# EAGLE design tcspc (EAGLE 9.1.2)

## Sheet 1 of 4
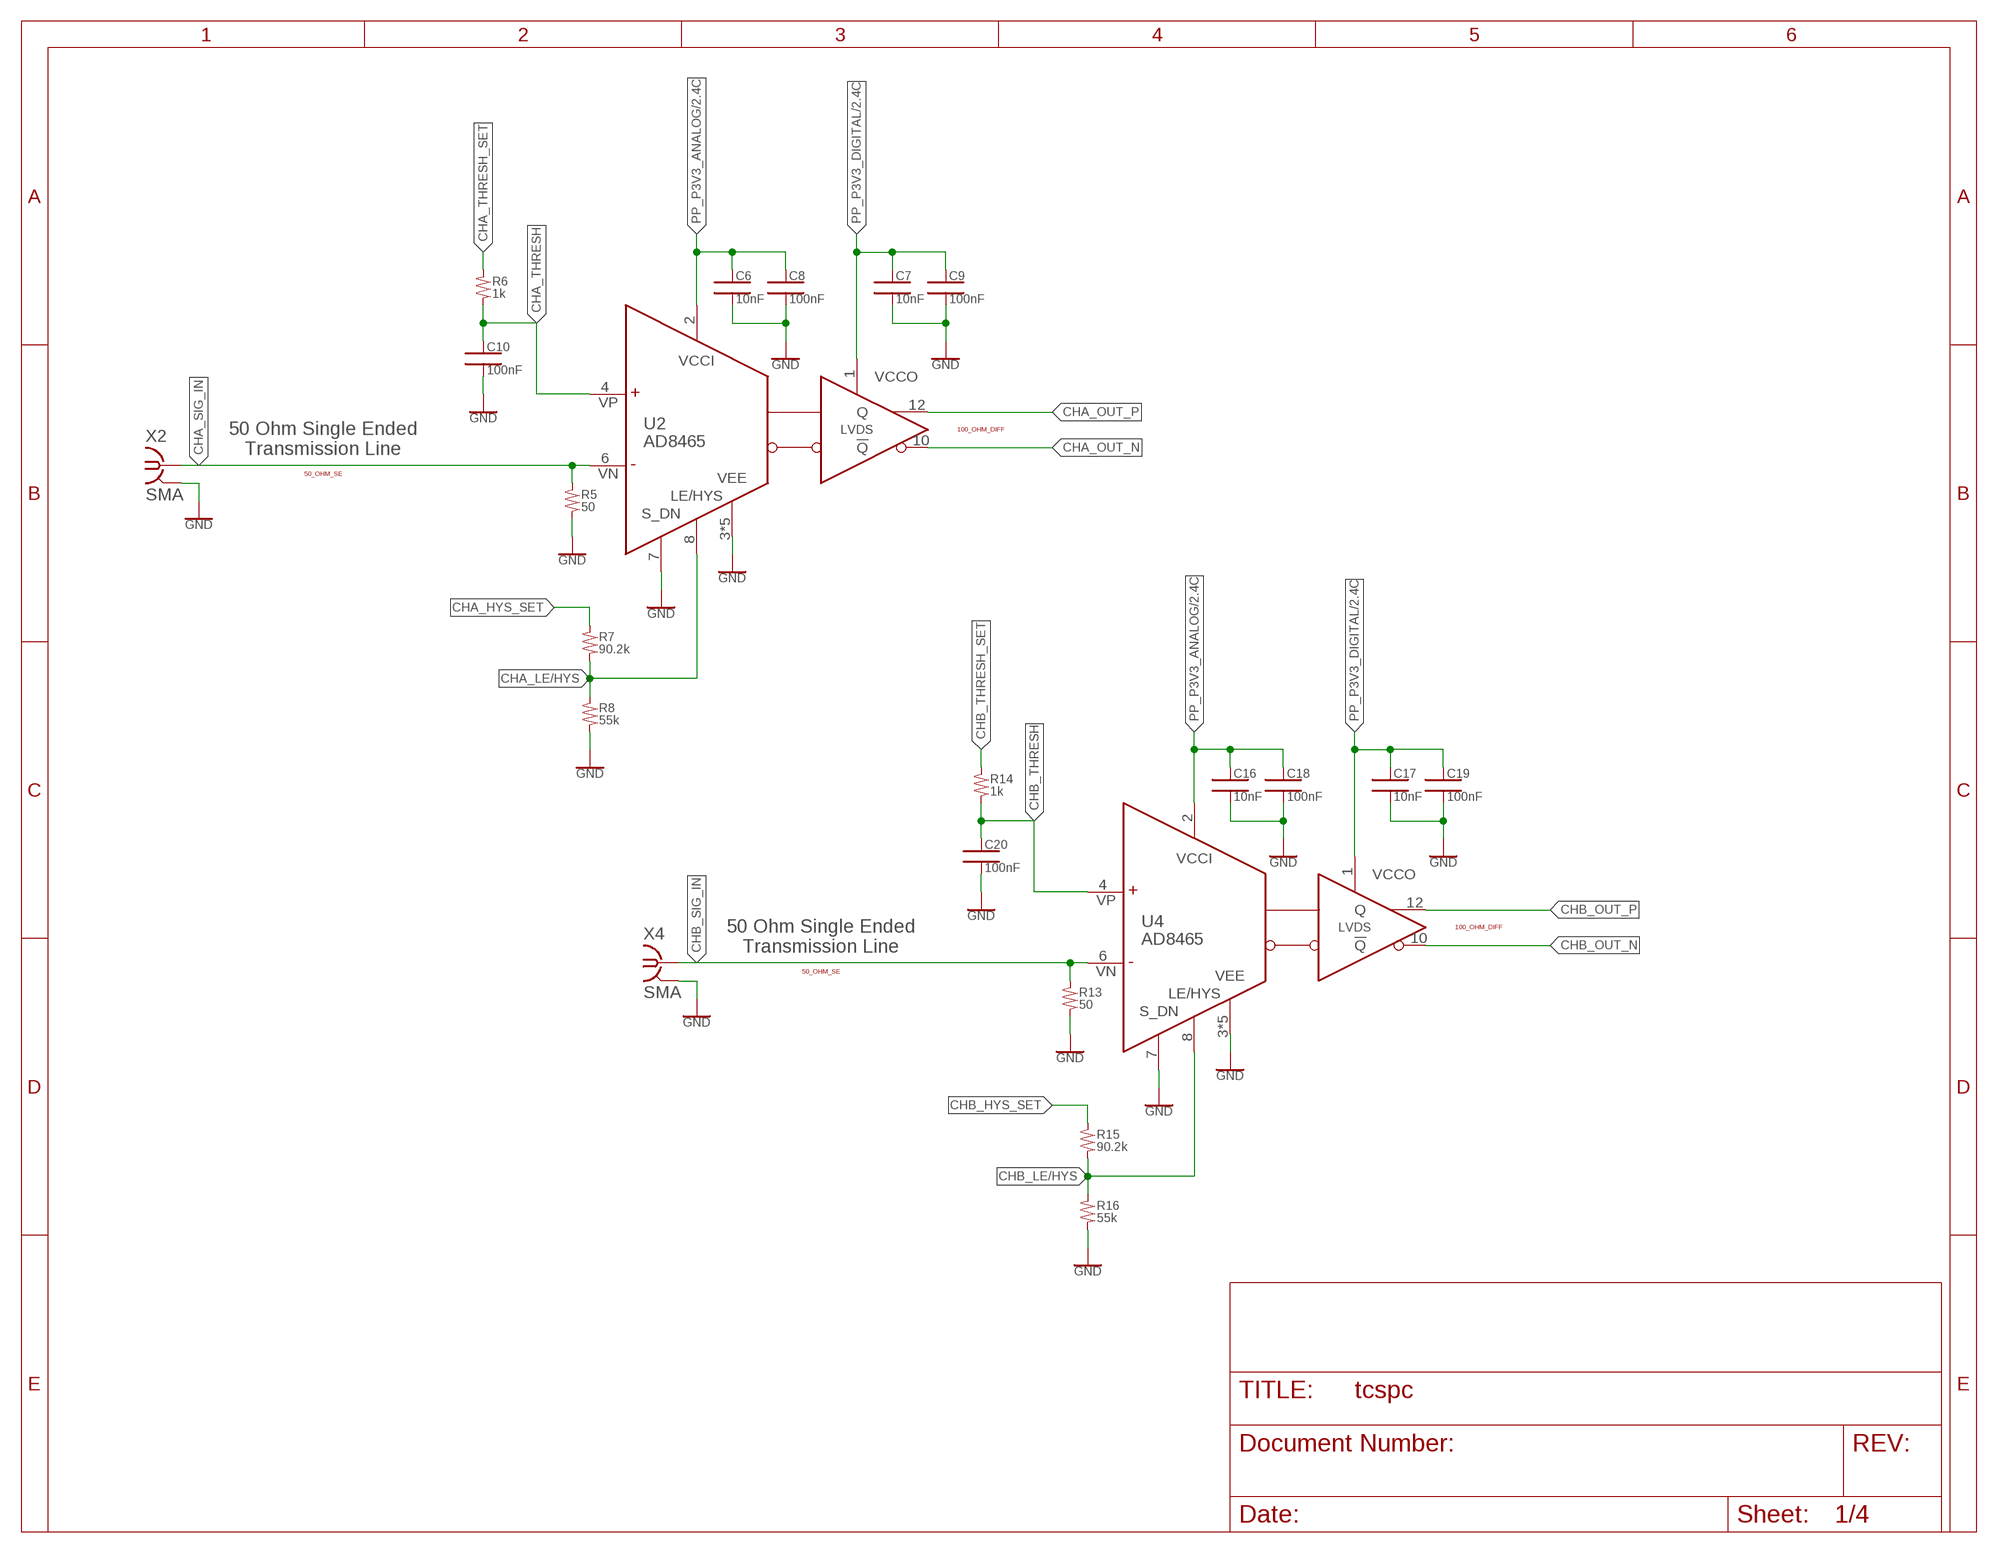
[diagram p0: schematic, sheet 1]

### Parts
C6  10nF  CAP_0402  [0402]
C7  10nF  CAP_0402  [0402]
C8  100nF  CAP_0402  [0402]
C9  100nF  CAP_0402  [0402]
C10  100nF  CAP_0402  [0402]
C16  10nF  CAP_0402  [0402]
C17  10nF  CAP_0402  [0402]
C18  100nF  CAP_0402  [0402]
C19  100nF  CAP_0402  [0402]
C20  100nF  CAP_0402  [0402]
R5  50  RES_0402  [0402]
R6  1k  RES_0402  [0402]
R7  90.2k  RES_0402  [0402]
R8  55k  RES_0402  [0402]
R13  50  RES_0402  [0402]
R14  1k  RES_0402  [0402]
R15  90.2k  RES_0402  [0402]
R16  55k  RES_0402  [0402]
U2  AD8465  [LFCSP-12]
U4  AD8465  [LFCSP-12]
X2  SMA  [J502-ND-142-0701-881/886]
X4  SMA  [J502-ND-142-0701-881/886]

### Nets
CHA_HYS_SET: R7.1
CHA_LE/HYS: R7.2 R8.1 U2.8(LE/HYS)
CHA_OUT_N [100_OHM_DIFF]: U2.10(!Q)
CHA_OUT_P [100_OHM_DIFF]: U2.12(Q)
CHA_SIG_IN: R5.1 U2.6(VN) X2.1
CHA_THRESH: C10.1 R6.2 U2.4(VP)
CHA_THRESH_SET: R6.1
CHB_HYS_SET: R15.1
CHB_LE/HYS: R15.2 R16.1 U4.8(LE/HYS)
CHB_OUT_N [100_OHM_DIFF]: U4.10(!Q)
CHB_OUT_P [100_OHM_DIFF]: U4.12(Q)
CHB_SIG_IN: R13.1 U4.6(VN) X4.1
CHB_THRESH: C20.1 R14.2 U4.4(VP)
CHB_THRESH_SET: R14.1
GND: C6.2 C7.2 C8.2 C9.2 C10.2 C16.2 C17.2 C18.2 C19.2 C20.2 R5.2 R8.2 R13.2 R16.2 U2.3(VEE) U2.5(VEE) U2.7(SDN) U2.9(VEE) U2.11(VEE) U2.EPAD(VEE) U4.3(VEE) U4.5(VEE) U4.7(SDN) U4.9(VEE) U4.11(VEE) U4.EPAD(VEE) X2.G@1(GND) X2.G@2(GND) X2.G@3(GND) X2.G@4(GND) X4.G@1(GND) X4.G@2(GND) X4.G@3(GND) X4.G@4(GND) ; also sheet 2,3,4
PP_P3V3_ANALOG: C6.1 C8.1 C16.1 C18.1 U2.2(VCCI) U4.2(VCCI) ; also sheet 2,4
PP_P3V3_DIGITAL: C7.1 C9.1 C17.1 C19.1 U2.1(VCCO) U4.1(VCCO) ; also sheet 2,4

### Notes on the sheet
- 100_OHM_DIFF
- 50 Ohm Single Ended
  Transmission Line
- 50_OHM_SE
- 100_OHM_DIFF
- 50 Ohm Single Ended
  Transmission Line
- 50_OHM_SE

## Sheet 2 of 4
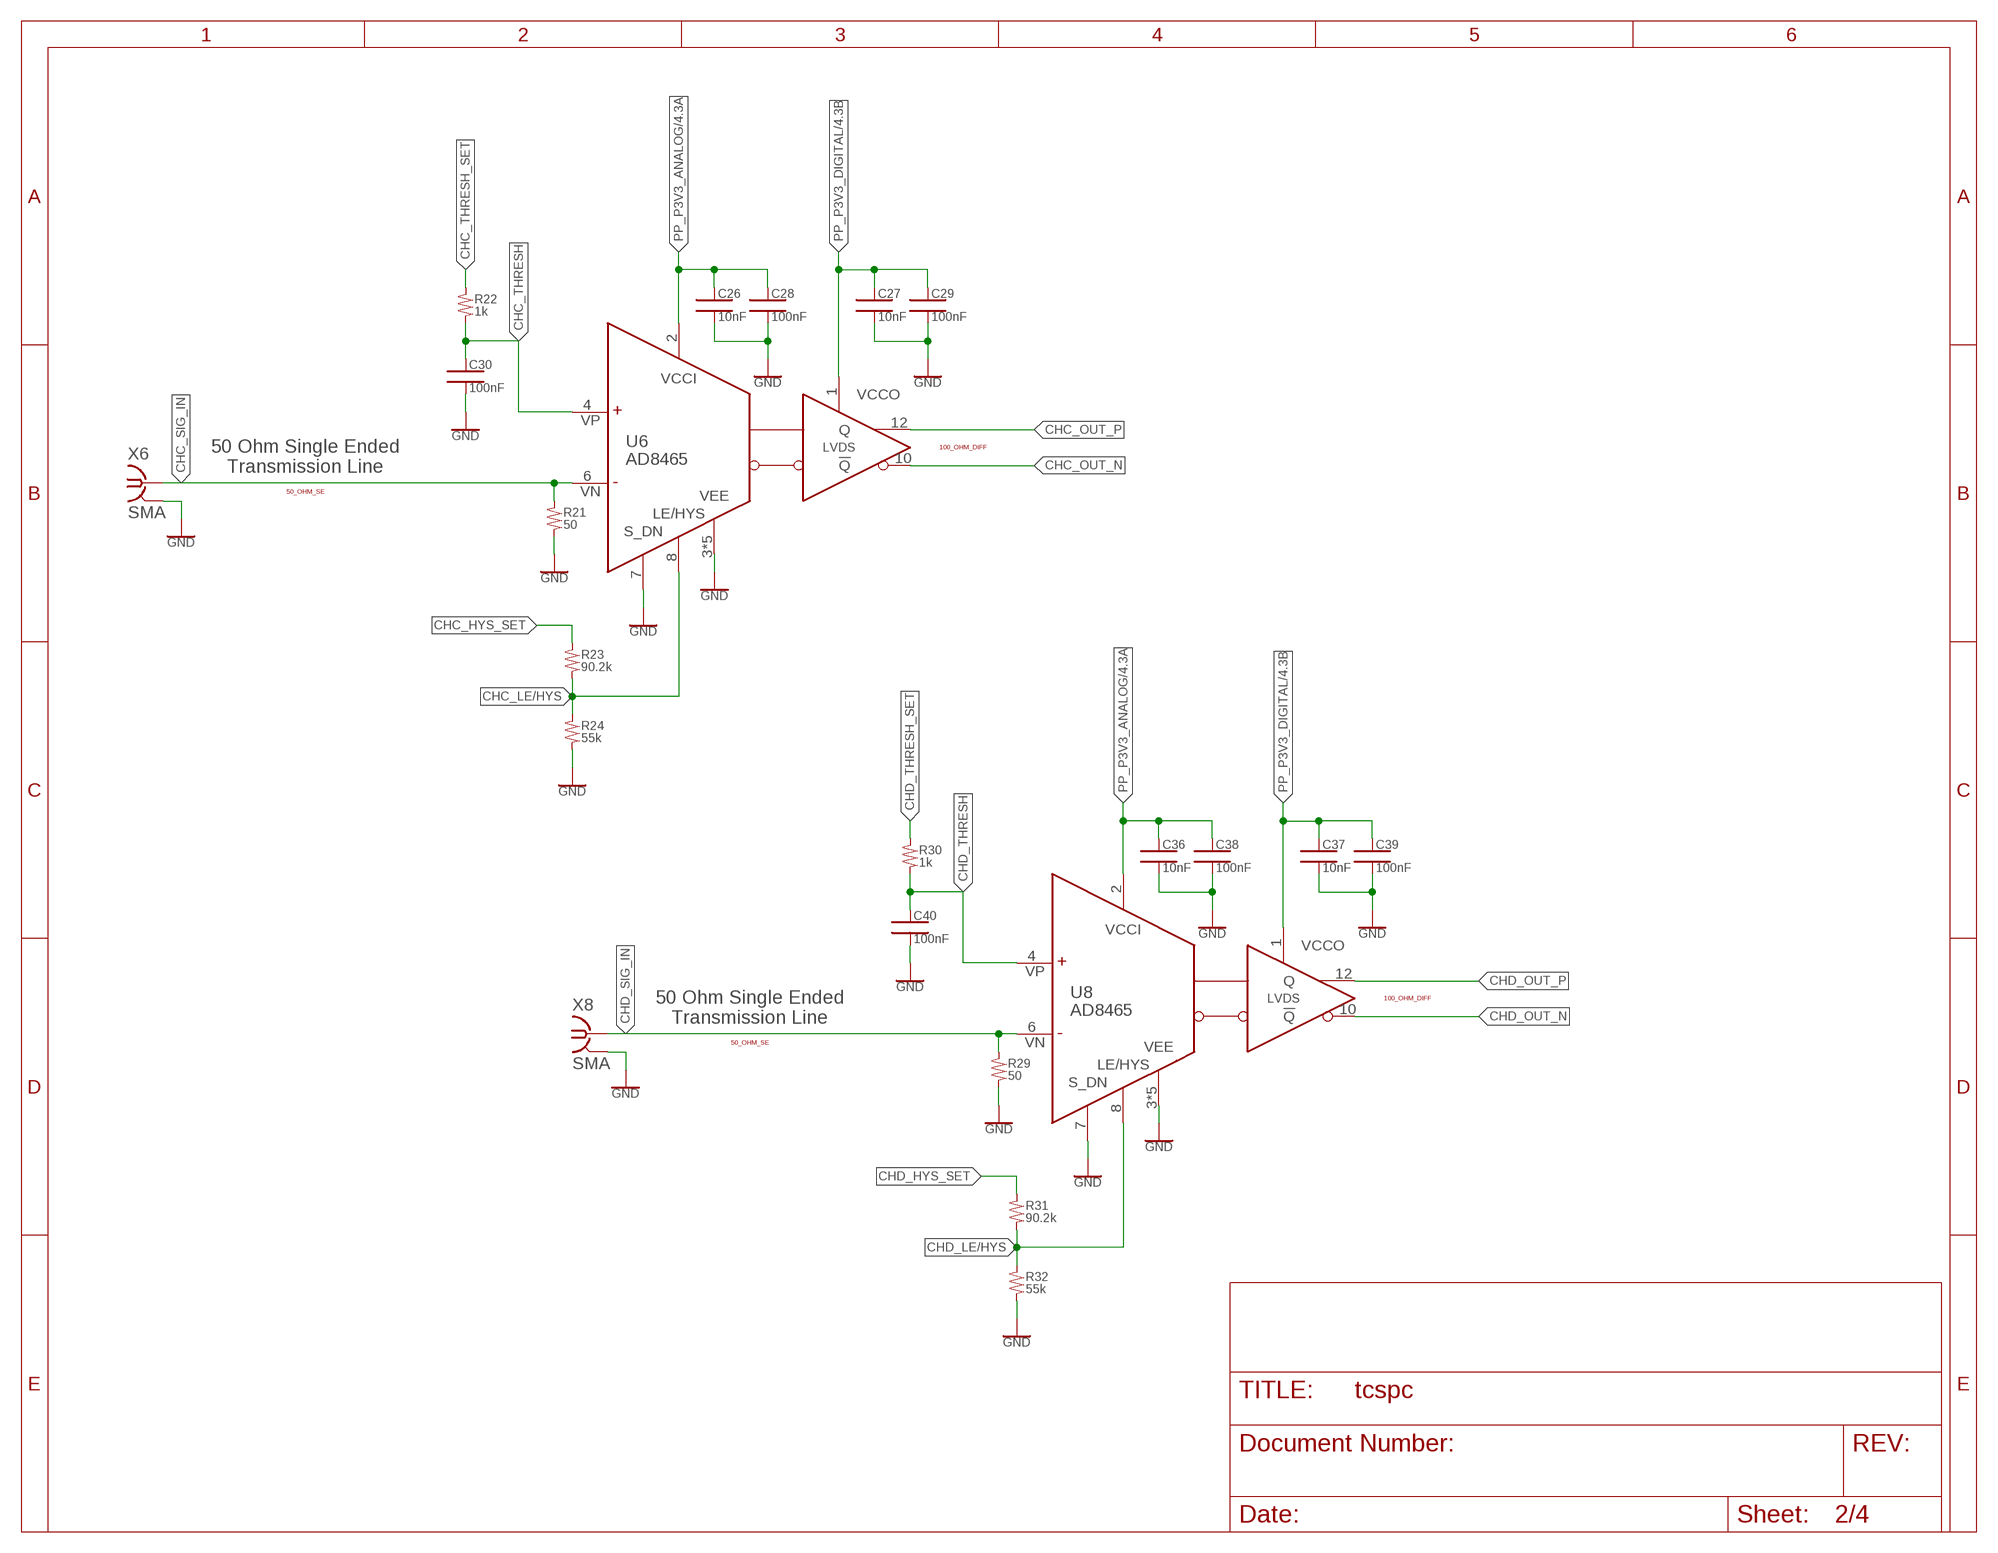
[diagram p1: schematic, sheet 2]

### Parts
C26  10nF  CAP_0402  [0402]
C27  10nF  CAP_0402  [0402]
C28  100nF  CAP_0402  [0402]
C29  100nF  CAP_0402  [0402]
C30  100nF  CAP_0402  [0402]
C36  10nF  CAP_0402  [0402]
C37  10nF  CAP_0402  [0402]
C38  100nF  CAP_0402  [0402]
C39  100nF  CAP_0402  [0402]
C40  100nF  CAP_0402  [0402]
R21  50  RES_0402  [0402]
R22  1k  RES_0402  [0402]
R23  90.2k  RES_0402  [0402]
R24  55k  RES_0402  [0402]
R29  50  RES_0402  [0402]
R30  1k  RES_0402  [0402]
R31  90.2k  RES_0402  [0402]
R32  55k  RES_0402  [0402]
U6  AD8465  [LFCSP-12]
U8  AD8465  [LFCSP-12]
X6  SMA  [J502-ND-142-0701-881/886]
X8  SMA  [J502-ND-142-0701-881/886]

### Nets
CHC_HYS_SET: R23.1
CHC_LE/HYS: R23.2 R24.1 U6.8(LE/HYS)
CHC_OUT_N [100_OHM_DIFF]: U6.10(!Q)
CHC_OUT_P [100_OHM_DIFF]: U6.12(Q)
CHC_SIG_IN: R21.1 U6.6(VN) X6.1
CHC_THRESH: C30.1 R22.2 U6.4(VP)
CHC_THRESH_SET: R22.1
CHD_HYS_SET: R31.1
CHD_LE/HYS: R31.2 R32.1 U8.8(LE/HYS)
CHD_OUT_N [100_OHM_DIFF]: U8.10(!Q)
CHD_OUT_P [100_OHM_DIFF]: U8.12(Q)
CHD_SIG_IN: R29.1 U8.6(VN) X8.1
CHD_THRESH: C40.1 R30.2 U8.4(VP)
CHD_THRESH_SET: R30.1
GND: C26.2 C27.2 C28.2 C29.2 C30.2 C36.2 C37.2 C38.2 C39.2 C40.2 R21.2 R24.2 R29.2 R32.2 U6.3(VEE) U6.5(VEE) U6.7(SDN) U6.9(VEE) U6.11(VEE) U6.EPAD(VEE) U8.3(VEE) U8.5(VEE) U8.7(SDN) U8.9(VEE) U8.11(VEE) U8.EPAD(VEE) X6.G@1(GND) X6.G@2(GND) X6.G@3(GND) X6.G@4(GND) X8.G@1(GND) X8.G@2(GND) X8.G@3(GND) X8.G@4(GND) ; also sheet 1,3,4
PP_P3V3_ANALOG: C26.1 C28.1 C36.1 C38.1 U6.2(VCCI) U8.2(VCCI) ; also sheet 1,4
PP_P3V3_DIGITAL: C27.1 C29.1 C37.1 C39.1 U6.1(VCCO) U8.1(VCCO) ; also sheet 1,4

### Notes on the sheet
- 100_OHM_DIFF
- 50 Ohm Single Ended
  Transmission Line
- 50_OHM_SE
- 100_OHM_DIFF
- 50 Ohm Single Ended
  Transmission Line
- 50_OHM_SE

## Sheet 3 of 4
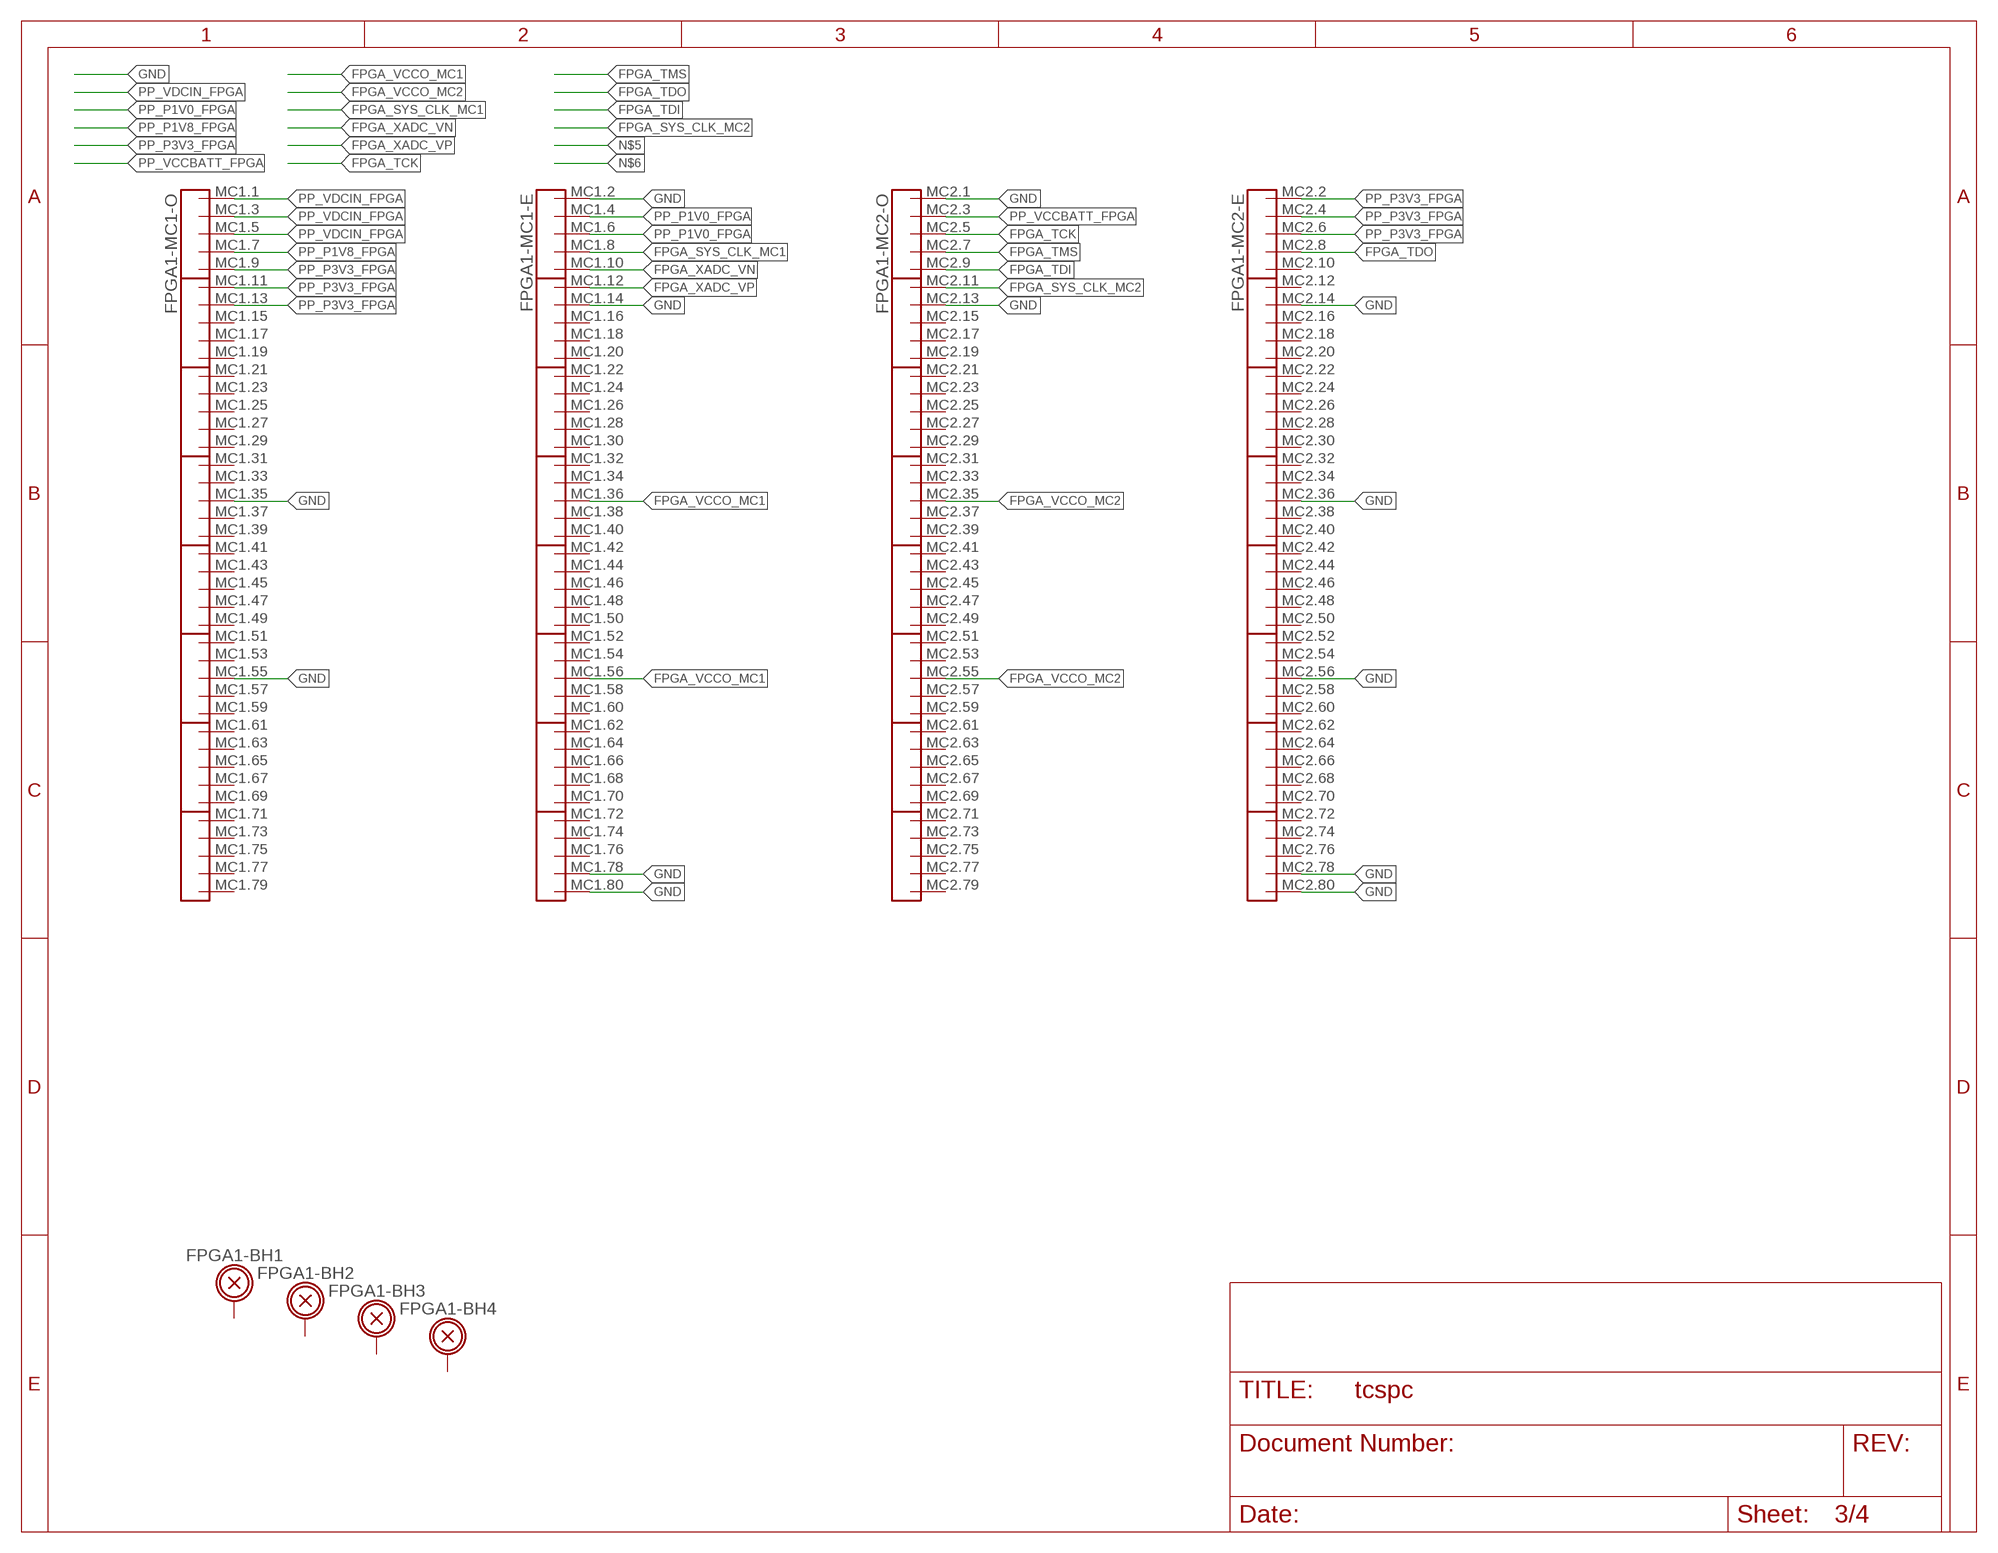
[diagram p2: schematic, sheet 3]

### Parts
FPGA1  XEM7310  [XEM7310]

### Nets
FPGA_SYS_CLK_MC1: FPGA1.MC1.8(-MC1-E:P4)
FPGA_SYS_CLK_MC2: FPGA1.MC2.11(-MC2-O:P6)
FPGA_TCK: FPGA1.MC2.5(-MC2-O:P3)
FPGA_TDI: FPGA1.MC2.9(-MC2-O:P5)
FPGA_TDO: FPGA1.MC2.8(-MC2-E:P4)
FPGA_TMS: FPGA1.MC2.7(-MC2-O:P4)
FPGA_VCCO_MC1: FPGA1.MC1.36(-MC1-E:P18) FPGA1.MC1.56(-MC1-E:P28)
FPGA_VCCO_MC2: FPGA1.MC2.35(-MC2-O:P18) FPGA1.MC2.55(-MC2-O:P28)
FPGA_XADC_VN: FPGA1.MC1.10(-MC1-E:P5)
FPGA_XADC_VP: FPGA1.MC1.12(-MC1-E:P6)
GND: FPGA1.MC1.2(-MC1-E:P1) FPGA1.MC1.14(-MC1-E:P7) FPGA1.MC1.35(-MC1-O:P18) FPGA1.MC1.55(-MC1-O:P28) FPGA1.MC1.78(-MC1-E:P39) FPGA1.MC1.80(-MC1-E:P40) FPGA1.MC2.1(-MC2-O:P1) FPGA1.MC2.13(-MC2-O:P7) FPGA1.MC2.14(-MC2-E:P7) FPGA1.MC2.36(-MC2-E:P18) FPGA1.MC2.56(-MC2-E:P28) FPGA1.MC2.78(-MC2-E:P39) FPGA1.MC2.80(-MC2-E:P40) ; also sheet 1,2,4
PP_P1V0_FPGA: FPGA1.MC1.4(-MC1-E:P2) FPGA1.MC1.6(-MC1-E:P3)
PP_P1V8_FPGA: FPGA1.MC1.7(-MC1-O:P4)
PP_P3V3_FPGA: FPGA1.MC1.9(-MC1-O:P5) FPGA1.MC1.11(-MC1-O:P6) FPGA1.MC1.13(-MC1-O:P7) FPGA1.MC2.2(-MC2-E:P1) FPGA1.MC2.4(-MC2-E:P2) FPGA1.MC2.6(-MC2-E:P3)
PP_VCCBATT_FPGA: FPGA1.MC2.3(-MC2-O:P2)
PP_VDCIN_FPGA: FPGA1.MC1.1(-MC1-O:P1) FPGA1.MC1.3(-MC1-O:P2) FPGA1.MC1.5(-MC1-O:P3)
Unconnected: FPGA1.BH1(-BH1:P) FPGA1.BH2(-BH2:P) FPGA1.BH3(-BH3:P) FPGA1.BH4(-BH4:P) FPGA1.MC1.15(-MC1-O:P8) FPGA1.MC1.16(-MC1-E:P8) FPGA1.MC1.17(-MC1-O:P9) FPGA1.MC1.18(-MC1-E:P9) FPGA1.MC1.19(-MC1-O:P10) FPGA1.MC1.20(-MC1-E:P10) FPGA1.MC1.21(-MC1-O:P11) FPGA1.MC1.22(-MC1-E:P11) FPGA1.MC1.23(-MC1-O:P12) FPGA1.MC1.24(-MC1-E:P12) FPGA1.MC1.25(-MC1-O:P13) FPGA1.MC1.26(-MC1-E:P13) FPGA1.MC1.27(-MC1-O:P14) FPGA1.MC1.28(-MC1-E:P14) FPGA1.MC1.29(-MC1-O:P15) FPGA1.MC1.30(-MC1-E:P15) FPGA1.MC1.31(-MC1-O:P16) FPGA1.MC1.32(-MC1-E:P16) FPGA1.MC1.33(-MC1-O:P17) FPGA1.MC1.34(-MC1-E:P17) FPGA1.MC1.37(-MC1-O:P19) FPGA1.MC1.38(-MC1-E:P19) FPGA1.MC1.39(-MC1-O:P20) FPGA1.MC1.40(-MC1-E:P20) FPGA1.MC1.41(-MC1-O:P21) FPGA1.MC1.42(-MC1-E:P21) FPGA1.MC1.43(-MC1-O:P22) FPGA1.MC1.44(-MC1-E:P22) FPGA1.MC1.45(-MC1-O:P23) FPGA1.MC1.46(-MC1-E:P23) FPGA1.MC1.47(-MC1-O:P24) FPGA1.MC1.48(-MC1-E:P24) FPGA1.MC1.49(-MC1-O:P25) FPGA1.MC1.50(-MC1-E:P25) FPGA1.MC1.51(-MC1-O:P26) FPGA1.MC1.52(-MC1-E:P26) FPGA1.MC1.53(-MC1-O:P27) FPGA1.MC1.54(-MC1-E:P27) FPGA1.MC1.57(-MC1-O:P29) FPGA1.MC1.58(-MC1-E:P29) FPGA1.MC1.59(-MC1-O:P30) FPGA1.MC1.60(-MC1-E:P30) FPGA1.MC1.61(-MC1-O:P31) FPGA1.MC1.62(-MC1-E:P31) FPGA1.MC1.63(-MC1-O:P32) FPGA1.MC1.64(-MC1-E:P32) FPGA1.MC1.65(-MC1-O:P33) FPGA1.MC1.66(-MC1-E:P33) FPGA1.MC1.67(-MC1-O:P34) FPGA1.MC1.68(-MC1-E:P34) FPGA1.MC1.69(-MC1-O:P35) FPGA1.MC1.70(-MC1-E:P35) FPGA1.MC1.71(-MC1-O:P36) FPGA1.MC1.72(-MC1-E:P36) FPGA1.MC1.73(-MC1-O:P37) FPGA1.MC1.74(-MC1-E:P37) FPGA1.MC1.75(-MC1-O:P38) FPGA1.MC1.76(-MC1-E:P38) FPGA1.MC1.77(-MC1-O:P39) FPGA1.MC1.79(-MC1-O:P40) FPGA1.MC2.10(-MC2-E:P5) FPGA1.MC2.12(-MC2-E:P6) FPGA1.MC2.15(-MC2-O:P8) FPGA1.MC2.16(-MC2-E:P8) FPGA1.MC2.17(-MC2-O:P9) FPGA1.MC2.18(-MC2-E:P9) FPGA1.MC2.19(-MC2-O:P10) FPGA1.MC2.20(-MC2-E:P10) FPGA1.MC2.21(-MC2-O:P11) FPGA1.MC2.22(-MC2-E:P11) FPGA1.MC2.23(-MC2-O:P12) FPGA1.MC2.24(-MC2-E:P12) FPGA1.MC2.25(-MC2-O:P13) FPGA1.MC2.26(-MC2-E:P13) FPGA1.MC2.27(-MC2-O:P14) FPGA1.MC2.28(-MC2-E:P14) FPGA1.MC2.29(-MC2-O:P15) FPGA1.MC2.30(-MC2-E:P15) FPGA1.MC2.31(-MC2-O:P16) FPGA1.MC2.32(-MC2-E:P16) FPGA1.MC2.33(-MC2-O:P17) FPGA1.MC2.34(-MC2-E:P17) FPGA1.MC2.37(-MC2-O:P19) FPGA1.MC2.38(-MC2-E:P19) FPGA1.MC2.39(-MC2-O:P20) FPGA1.MC2.40(-MC2-E:P20) FPGA1.MC2.41(-MC2-O:P21) FPGA1.MC2.42(-MC2-E:P21) FPGA1.MC2.43(-MC2-O:P22) FPGA1.MC2.44(-MC2-E:P22) FPGA1.MC2.45(-MC2-O:P23) FPGA1.MC2.46(-MC2-E:P23) FPGA1.MC2.47(-MC2-O:P24) FPGA1.MC2.48(-MC2-E:P24) FPGA1.MC2.49(-MC2-O:P25) FPGA1.MC2.50(-MC2-E:P25) FPGA1.MC2.51(-MC2-O:P26) FPGA1.MC2.52(-MC2-E:P26) FPGA1.MC2.53(-MC2-O:P27) FPGA1.MC2.54(-MC2-E:P27) FPGA1.MC2.57(-MC2-O:P29) FPGA1.MC2.58(-MC2-E:P29) FPGA1.MC2.59(-MC2-O:P30) FPGA1.MC2.60(-MC2-E:P30) FPGA1.MC2.61(-MC2-O:P31) FPGA1.MC2.62(-MC2-E:P31) FPGA1.MC2.63(-MC2-O:P32) FPGA1.MC2.64(-MC2-E:P32) FPGA1.MC2.65(-MC2-O:P33) FPGA1.MC2.66(-MC2-E:P33) FPGA1.MC2.67(-MC2-O:P34) FPGA1.MC2.68(-MC2-E:P34) FPGA1.MC2.69(-MC2-O:P35) FPGA1.MC2.70(-MC2-E:P35) FPGA1.MC2.71(-MC2-O:P36) FPGA1.MC2.72(-MC2-E:P36) FPGA1.MC2.73(-MC2-O:P37) FPGA1.MC2.74(-MC2-E:P37) FPGA1.MC2.75(-MC2-O:P38) FPGA1.MC2.76(-MC2-E:P38) FPGA1.MC2.77(-MC2-O:P39) FPGA1.MC2.79(-MC2-O:P40)

## Sheet 4 of 4
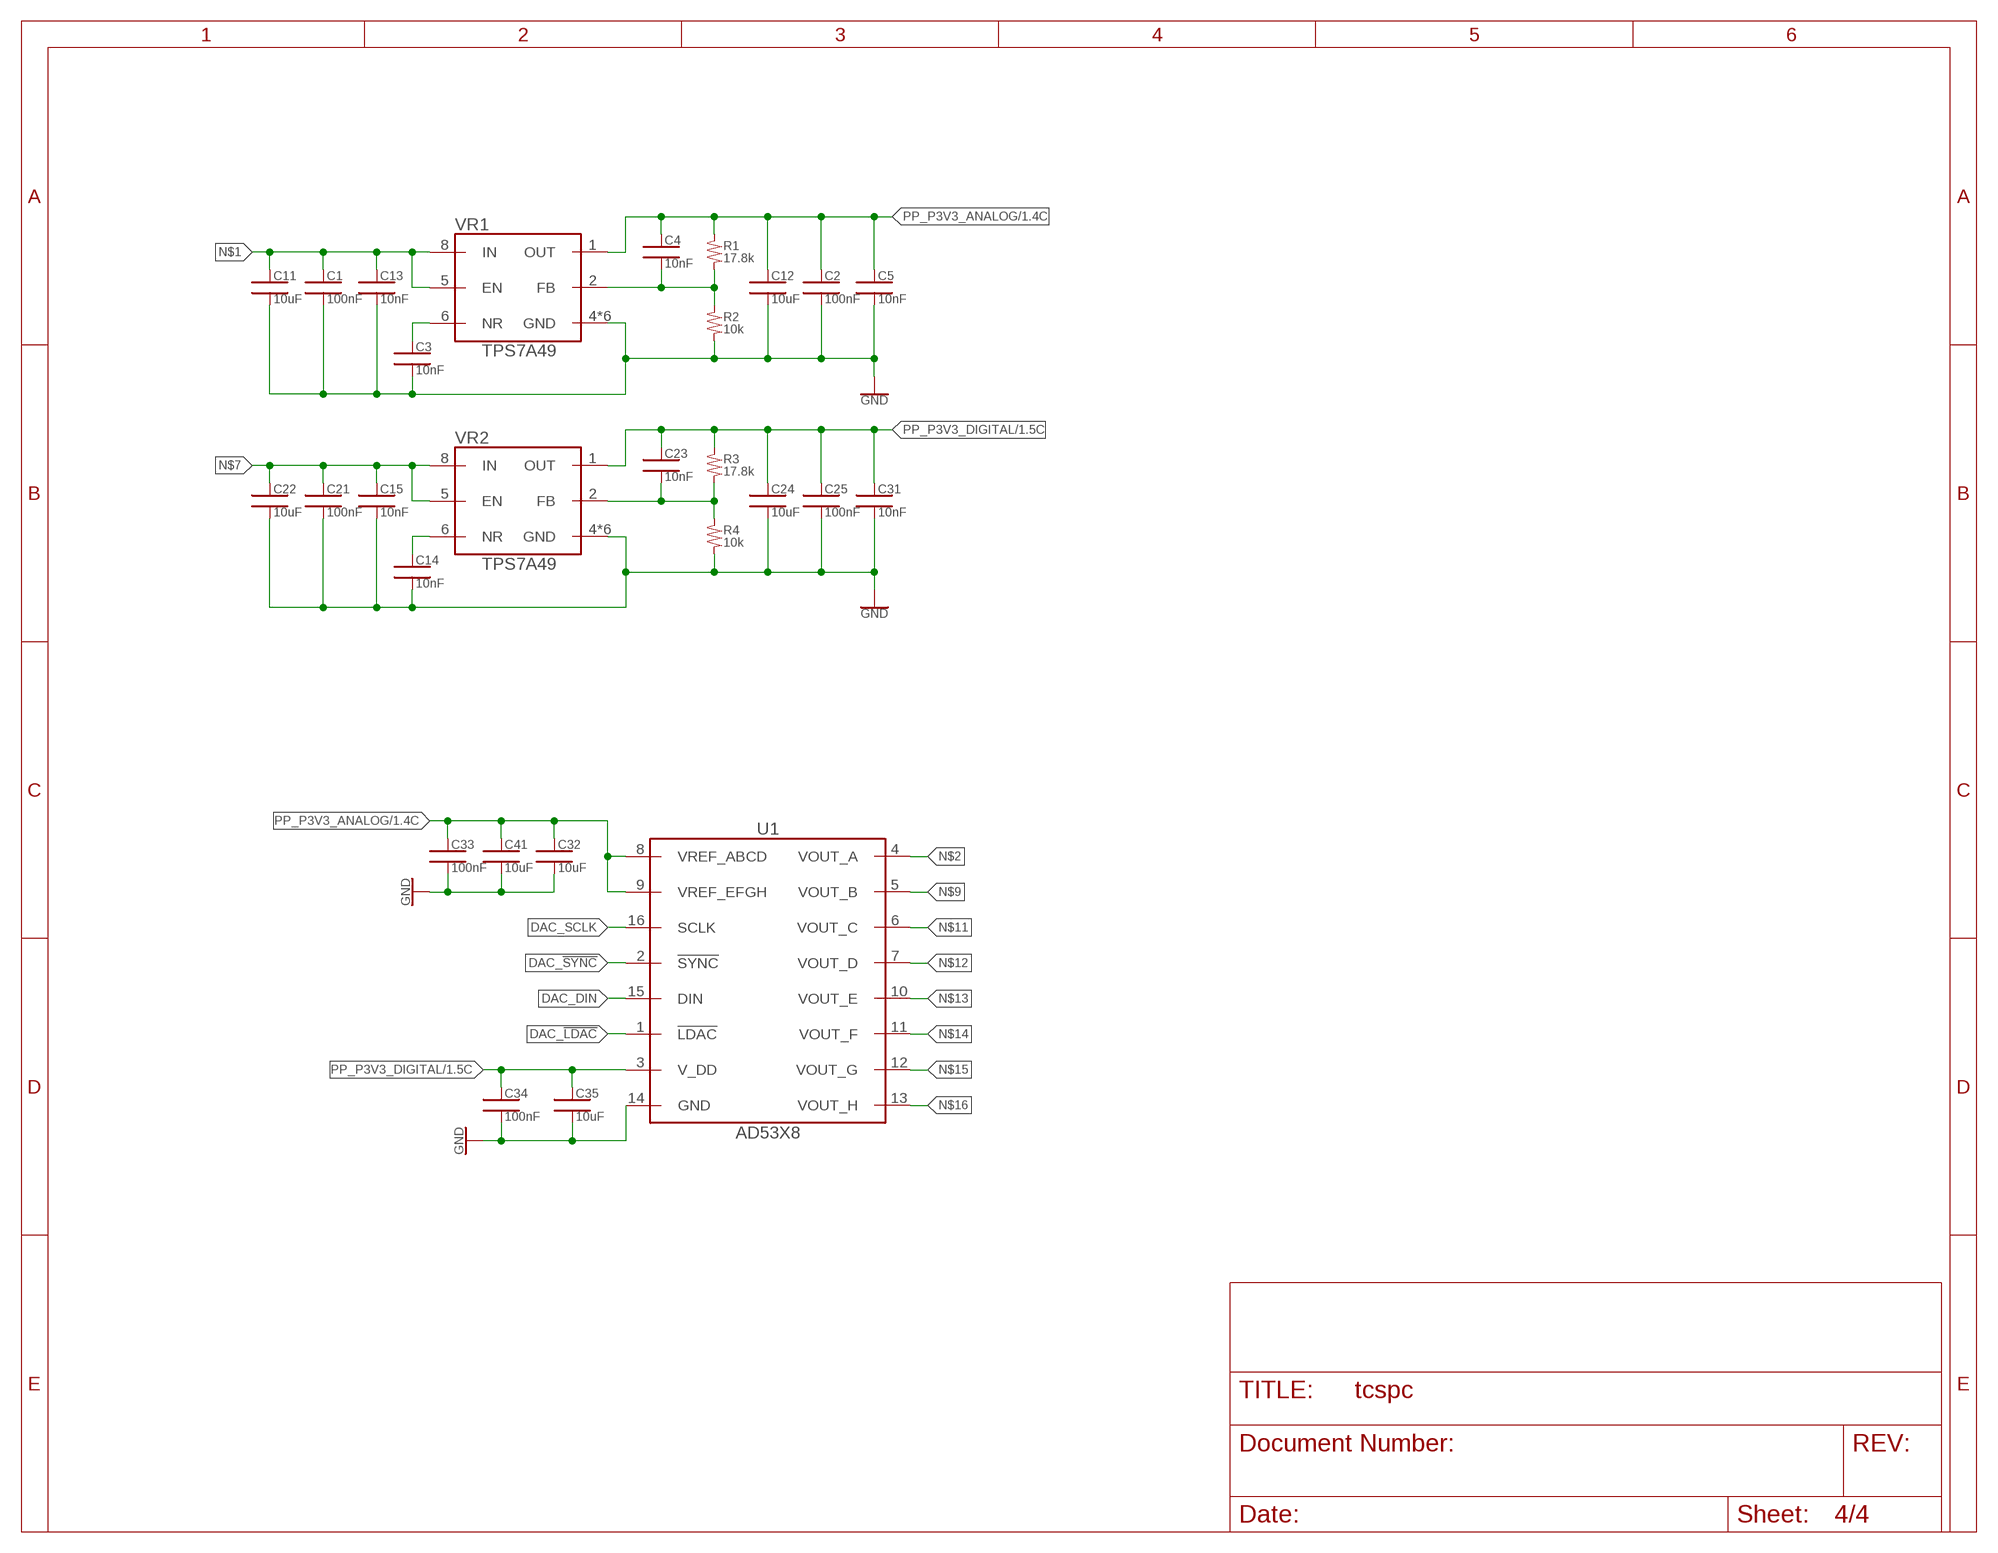
[diagram p3: schematic, sheet 4]

### Parts
C1  100nF  CAP_0402  [0402]
C2  100nF  CAP_0402  [0402]
C3  10nF  CAP_0402  [0402]
C4  10nF  CAP_0402  [0402]
C5  10nF  CAP_0402  [0402]
C11  10uF  CAP_0603  [0603]
C12  10uF  CAP_0603  [0603]
C13  10nF  CAP_0402  [0402]
C14  10nF  CAP_0402  [0402]
C15  10nF  CAP_0402  [0402]
C21  100nF  CAP_0402  [0402]
C22  10uF  CAP_0603  [0603]
C23  10nF  CAP_0402  [0402]
C24  10uF  CAP_0603  [0603]
C25  100nF  CAP_0402  [0402]
C31  10nF  CAP_0402  [0402]
C32  10uF  CAP_0402  [0402]
C33  100nF  CAP_0402  [0402]
C34  100nF  CAP_0402  [0402]
C35  10uF  CAP_0402  [0402]
C41  10uF  CAP_0402  [0402]
R1  17.8k  RES_0402  [0402]
R2  10k  RES_0402  [0402]
R3  17.8k  RES_0402  [0402]
R4  10k  RES_0402  [0402]
U1  AD53X8  [TSSOP-16]
VR1  TPS7A49  [VSON]
VR2  TPS7A49  [VSON]

### Nets
DAC_!LDAC!: U1.1(!LDAC)
DAC_!SYNC!: U1.2(!SYNC)
DAC_DIN: U1.15(DIN)
DAC_SCLK: U1.16(SCLK)
GND: C1.2 C2.2 C3.2 C5.2 C11.2 C12.2 C13.2 C14.2 C15.2 C21.2 C22.2 C24.2 C25.2 C31.2 C32.2 C33.2 C34.2 C35.2 C41.2 R2.2 R4.2 U1.14(GND) VR1.4(GND) VR1.TP(GND) VR1.TP_A(GND) VR1.TP_B(GND) VR1.TP_C(GND) VR1.TP_D(GND) VR2.4(GND) VR2.TP(GND) VR2.TP_A(GND) VR2.TP_B(GND) VR2.TP_C(GND) VR2.TP_D(GND) ; also sheet 1,2,3
N$1: C1.1 C11.1 C13.1 VR1.5(EN) VR1.8(IN)
N$2: U1.4(VOUT_A)
N$3: C4.2 R1.2 R2.1 VR1.2(FB)
N$4: C3.1 VR1.6(NR)
N$7: C15.1 C21.1 C22.1 VR2.5(EN) VR2.8(IN)
N$8: C14.1 VR2.6(NR)
N$9: U1.5(VOUT_B)
N$10: C23.2 R3.2 R4.1 VR2.2(FB)
N$11: U1.6(VOUT_C)
N$12: U1.7(VOUT_D)
N$13: U1.10(VOUT_E)
N$14: U1.11(VOUT_F)
N$15: U1.12(VOUT_G)
N$16: U1.13(VOUT_H)
PP_P3V3_ANALOG: C2.1 C4.1 C5.1 C12.1 C32.1 C33.1 C41.1 R1.1 U1.8(VREF_ABCD) U1.9(VREF_EFGH) VR1.1(OUT) ; also sheet 1,2
PP_P3V3_DIGITAL: C23.1 C24.1 C25.1 C31.1 C34.1 C35.1 R3.1 U1.3(V_DD) VR2.1(OUT) ; also sheet 1,2

## Library data of the parts
C1-C41 = tcspc_lib:CAP
FPGA1 = tcspc_lib:XEM7310
R1-R8 R13-R16 R21-R24 R29-R32 = tcspc_lib:RES
U1 = tcspc_lib:AD53X8: 8/10/12 bit, 2.5v to 5.5v, 8 channel DAC
U2 U4 U6 U8 = tcspc_lib:AD8465
VR1 VR2 = tcspc_lib:TPS7A49: 36v 150mA ultralow noise positive linear regulator http://www.ti.com/lit/ds/symlink/tps7a49.pdf
X2 X4 X6 X8 = tcspc_lib:SMA

## Net classes
1 50_OHM_SE: width 0.203 mm
2 100_OHM_DIFF: width 0.152 mm, clearance 0.29 mm

## Board
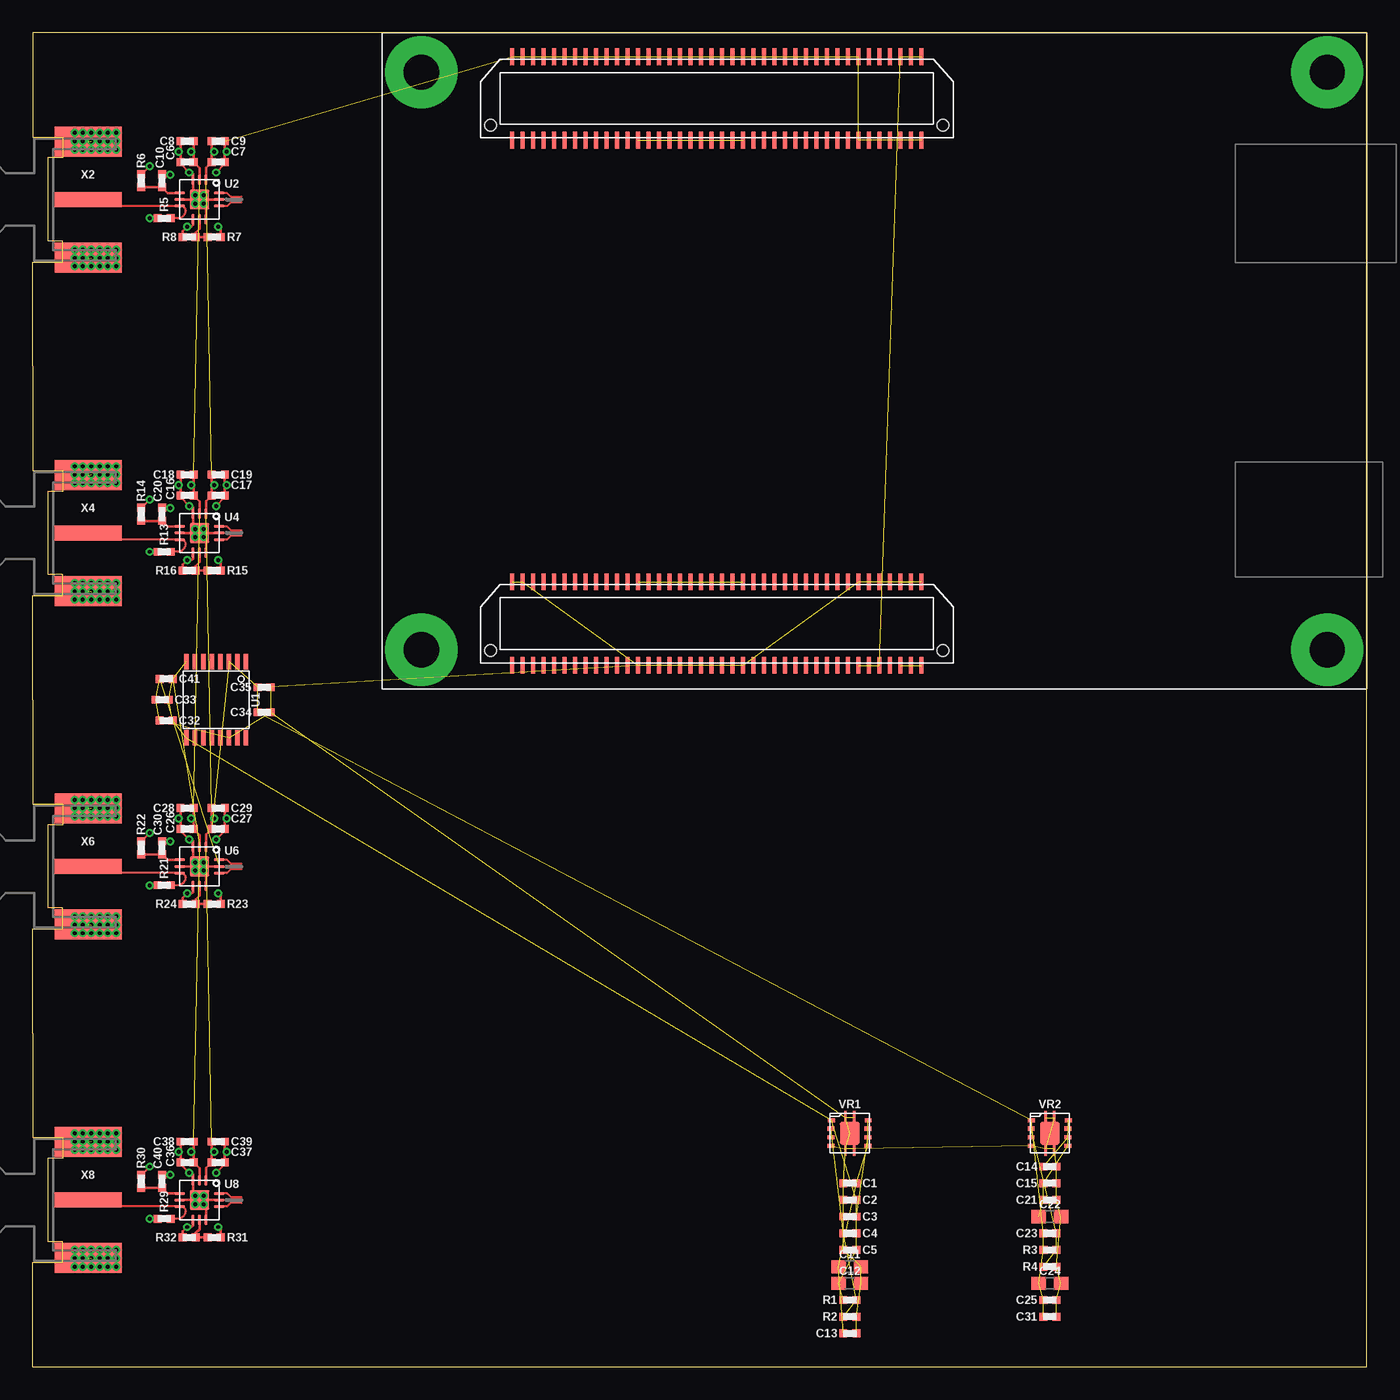
[diagram p4: board, top side]
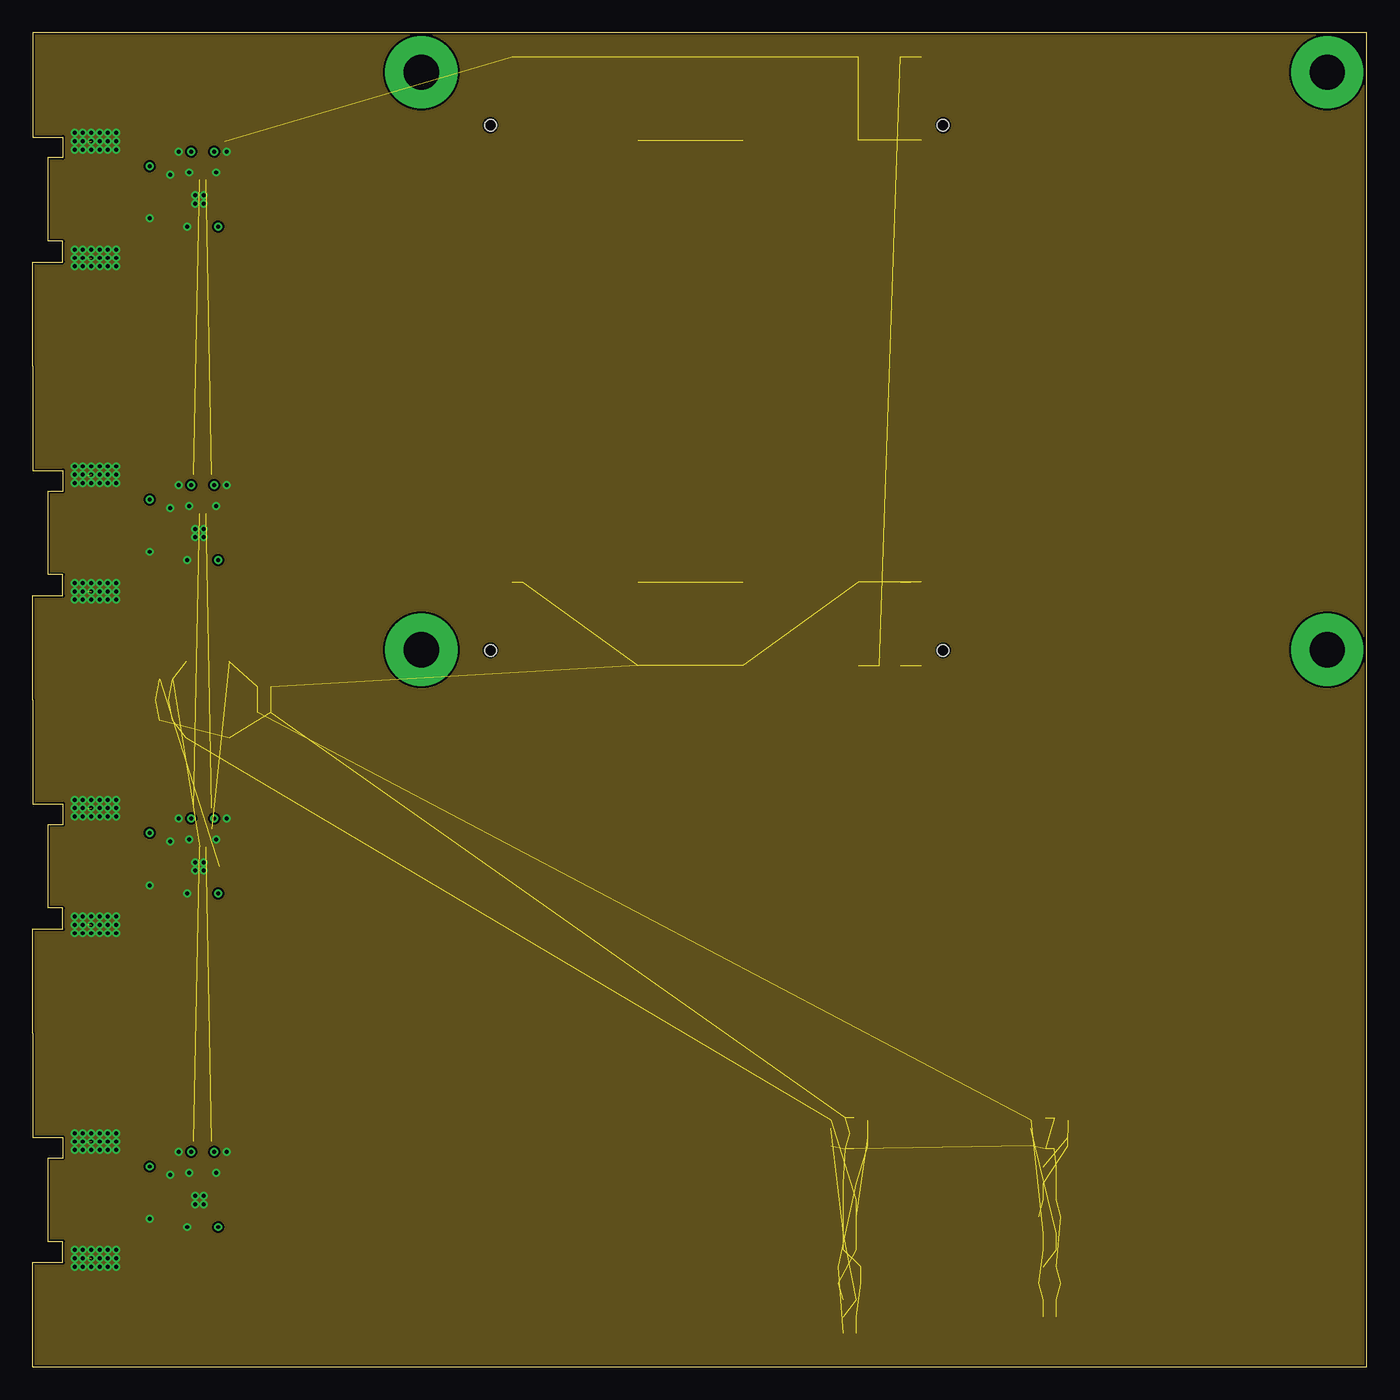
[diagram p5: board, inner layer Route2]
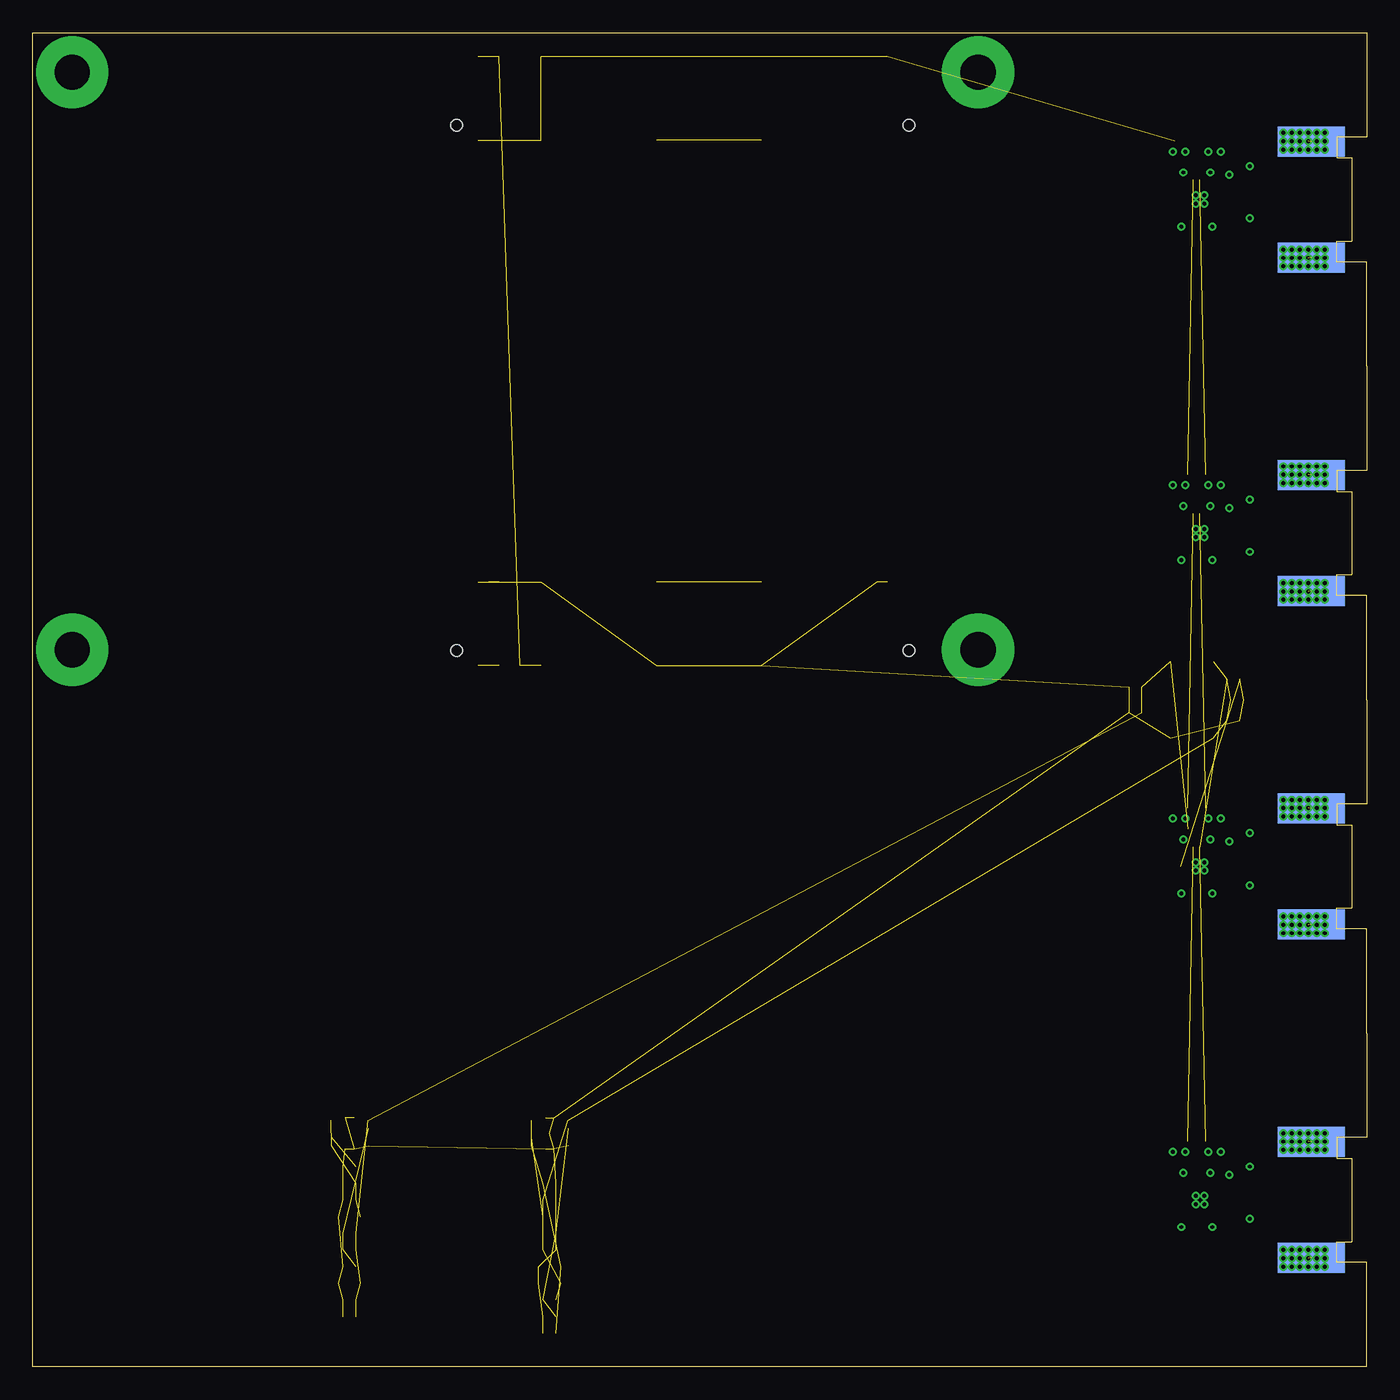
[diagram p6: board, bottom side, seen from below]

Size 101.6 x 101.6 mm. Coordinates in mm from the lower left corner, seen from the top.
Outline: 0,0 101.6,0 101.6,101.6 0,101.6 0,93.66 2.29,93.66 2.29,92.08 1.14,92.08 1.14,85.72 2.29,85.72 2.29,84.14 0,84.14 0,76.2 0,68.26 2.29,68.26 2.29,66.67 1.14,66.67 1.14,60.33 2.29,60.33 2.29,58.74 0,58.74 0,50.8 0,42.86 2.29,42.86 2.29,41.27 1.14,41.27 1.14,34.92 2.29,34.92 2.29,33.34 0,33.34 0,25.4 0,17.46 2.29,17.46 2.29,15.88 1.14,15.88 1.14,9.53 2.29,9.53 2.29,7.94 0,7.94 0,0
Copper layers (1+2*15+16): Top 0.035mm / dielectric 1.5mm / Route2 0.035mm / dielectric 0.15mm / Route15 0.035mm / dielectric 0.2mm / Bottom 0.035mm
Design rules "3PCB_4layer": minimum track width 6mil, minimum drill 0.3mm, track to track 6mil, track to pad 6mil, pad to pad 6mil, via to via 6mil, smd to smd 0mil, copper to edge 6mil, drill to drill 6mil, minimum pad ring 6mil, minimum via ring 6mil, stop-mask expansion 2mil, vias tented up to drill 0.3mm, thermal gap 10mil

### Footprints (pad centres in the part's own frame; a part is rotated, then mirrored left to right if it is on the bottom)
0402 = smd 0.6 x 0.6: 1 -0.5,0; 2 0.5,0
0603 = smd 1.1 x 1: 1 -0.85,0; 2 0.85,0
XEM7310 = drill 2.7 pad 5.5: BH1 3,3; BH2 3,47; BH3 72,47; BH4 72,3 | smd 0.305 x 1.27: MC1.1 33.898,48.175; MC1.2 33.898,41.825; MC1.3 34.698,48.175; MC1.4 34.698,41.825; MC1.5 35.498,48.175; MC1.6 35.498,41.825; MC1.7 36.298,48.175; MC1.8 36.298,41.825; MC1.9 37.098,48.175; MC1.10 37.098,41.825; MC1.11 37.899,48.175; MC1.12 37.899,41.825; MC1.13 38.699,48.175; MC1.14 38.699,41.825; MC1.15 39.499,48.175; MC1.16 39.499,41.825; MC1.17 40.299,48.175; MC1.18 40.299,41.825; MC1.19 41.099,48.175; MC1.20 41.099,41.825; MC1.21 41.899,48.175; MC1.22 41.899,41.825; MC1.23 42.699,48.175; MC1.24 42.699,41.825; MC1.25 43.499,48.175; MC1.26 43.499,41.825; MC1.27 44.299,48.175; MC1.28 44.299,41.825; MC1.29 45.099,48.175; MC1.30 45.099,41.825; MC1.31 45.9,48.175; MC1.32 45.9,41.825; MC1.33 46.7,48.175; MC1.34 46.7,41.825; MC1.35 47.5,48.175; MC1.36 47.5,41.825; MC1.37 48.3,48.175; MC1.38 48.3,41.825; MC1.39 49.1,48.175; MC1.40 49.1,41.825; MC1.41 49.9,48.175; MC1.42 49.9,41.825; MC1.43 50.7,48.175; MC1.44 50.7,41.825; MC1.45 51.5,48.175; MC1.46 51.5,41.825; MC1.47 52.3,48.175; MC1.48 52.3,41.825; MC1.49 53.1,48.175; MC1.50 53.1,41.825; MC1.51 53.901,48.175; MC1.52 53.901,41.825; MC1.53 54.701,48.175; MC1.54 54.701,41.825; MC1.55 55.501,48.175; MC1.56 55.501,41.825; MC1.57 56.301,48.175; MC1.58 56.301,41.825; MC1.59 57.101,48.175; MC1.60 57.101,41.825; MC1.61 57.901,48.175; MC1.62 57.901,41.825; MC1.63 58.701,48.175; MC1.64 58.701,41.825; MC1.65 59.501,48.175; MC1.66 59.501,41.825; MC1.67 60.301,48.175; MC1.68 60.301,41.825; MC1.69 61.101,48.175; MC1.70 61.101,41.825; MC1.71 61.902,48.175; MC1.72 61.902,41.825; MC1.73 62.702,48.175; MC1.74 62.702,41.825; MC1.75 63.502,48.175; MC1.76 63.502,41.825; MC1.77 64.302,48.175; MC1.78 64.302,41.825; MC1.79 65.102,48.175; MC1.80 65.102,41.825; MC2.1 33.898,8.175; MC2.2 33.898,1.825; MC2.3 34.698,8.175; MC2.4 34.698,1.825; MC2.5 35.498,8.175; MC2.6 35.498,1.825; MC2.7 36.298,8.175; MC2.8 36.298,1.825; MC2.9 37.098,8.175; MC2.10 37.098,1.825; MC2.11 37.899,8.175; MC2.12 37.899,1.825; MC2.13 38.699,8.175; MC2.14 38.699,1.825; MC2.15 39.499,8.175; MC2.16 39.499,1.825; MC2.17 40.299,8.175; MC2.18 40.299,1.825; MC2.19 41.099,8.175; MC2.20 41.099,1.825; MC2.21 41.899,8.175; MC2.22 41.899,1.825; MC2.23 42.699,8.175; MC2.24 42.699,1.825; MC2.25 43.499,8.175; MC2.26 43.499,1.825; MC2.27 44.299,8.175; MC2.28 44.299,1.825; MC2.29 45.099,8.175; MC2.30 45.099,1.825; MC2.31 45.9,8.175; MC2.32 45.9,1.825; MC2.33 46.7,8.175; MC2.34 46.7,1.825; MC2.35 47.5,8.175; MC2.36 47.5,1.825; MC2.37 48.3,8.175; MC2.38 48.3,1.825; MC2.39 49.1,8.175; MC2.40 49.1,1.825; MC2.41 49.9,8.175; MC2.42 49.9,1.825; MC2.43 50.7,8.175; MC2.44 50.7,1.825; MC2.45 51.5,8.175; MC2.46 51.5,1.825; MC2.47 52.3,8.175; MC2.48 52.3,1.825; MC2.49 53.1,8.175; MC2.50 53.1,1.825; MC2.51 53.901,8.175; MC2.52 53.901,1.825; MC2.53 54.701,8.175; MC2.54 54.701,1.825; MC2.55 55.501,8.175; MC2.56 55.501,1.825; MC2.57 56.301,8.175; MC2.58 56.301,1.825; MC2.59 57.101,8.175; MC2.60 57.101,1.825; MC2.61 57.901,8.175; MC2.62 57.901,1.825; MC2.63 58.701,8.175; MC2.64 58.701,1.825; MC2.65 59.501,8.175; MC2.66 59.501,1.825; MC2.67 60.301,8.175; MC2.68 60.301,1.825; MC2.69 61.101,8.175; MC2.70 61.101,1.825; MC2.71 61.902,8.175; MC2.72 61.902,1.825; MC2.73 62.702,8.175; MC2.74 62.702,1.825; MC2.75 63.502,8.175; MC2.76 63.502,1.825; MC2.77 64.302,8.175; MC2.78 64.302,1.825; MC2.79 65.102,8.175; MC2.80 65.102,1.825 | hole 0.889: 32.26,47.032; 66.74,47.032; 32.26,7.032; 66.74,7.032
TSSOP-16 = smd 1.2 x 0.35: 1 -2.9,2.275; 2 -2.9,1.625; 3 -2.9,0.975; 4 -2.9,0.325; 5 -2.9,-0.325; 6 -2.9,-0.975; 7 -2.9,-1.625; 8 -2.9,-2.275; 9 2.9,-2.275; 10 2.9,-1.625; 11 2.9,-0.975; 12 2.9,-0.325; 13 2.9,0.325; 14 2.9,0.975; 15 2.9,1.625; 16 2.9,2.275
LFCSP-12 = smd 0.8 x 0.23: 1 -1.5,0.5; 2 -1.5,0; 3 -1.5,-0.5; 7 1.5,-0.5; 8 1.5,0; 9 1.5,0.5 | smd 0.23 x 0.8: 4 -0.5,-1.5; 5 0,-1.5; 6 0.5,-1.5; 10 0.5,1.5; 11 0,1.5; 12 -0.5,1.5 | smd 1.5 x 1.5: EPAD 0,0
VSON = smd 0.6 x 0.31: 1 -1.4,0.975; 2 -1.43,0.355; 3 -1.43,-0.295; 4 -1.43,-0.945; 5 1.37,-0.945; 6 1.37,-0.295; 7 1.37,0.355; 8 1.4,0.975 | smd 1.5 x 1.75: TP 0,0 | smd 0.23 x 1.025: TP_A -0.325,1.188; TP_B -0.325,-1.188; TP_C 0.325,-1.188; TP_D 0.325,1.188
J502-ND-142-0701-881/886 = smd 5.08 x 1.143: 1 2.565,0 | smd 5.08 x 2.286: G@1 2.565,4.42; G@2 2.565,-4.42 | smd 5.08 x 2.286 bottom: G@3 2.565,4.42; G@4 2.565,-4.42

### Placement (x,y rotation side)
C1  62.23,13.97 180 top
C2  62.23,12.7 180 top
C3  62.23,11.43 180 top
C4  62.23,10.16 180 top
C5  62.23,8.89 180 top
C6  11.75,91.76 180 top
C7  14.13,91.76 0 top
C8  11.75,93.34 180 top
C9  14.13,93.34 0 top
C10  9.84,90.33 90 top
C11  62.23,7.62 0 top
C12  62.23,6.35 0 top
C13  62.23,2.54 0 top
C14  77.47,15.24 0 top
C15  77.47,13.97 0 top
C16  11.75,66.36 180 top
C17  14.13,66.36 0 top
C18  11.75,67.94 180 top
C19  14.13,67.94 0 top
C20  9.84,64.93 90 top
C21  77.47,12.7 0 top
C22  77.47,11.43 0 top
C23  77.47,10.16 0 top
C24  77.47,6.35 0 top
C25  77.47,5.08 0 top
C26  11.75,40.96 180 top
C27  14.13,40.96 0 top
C28  11.75,42.55 180 top
C29  14.13,42.55 0 top
C30  9.84,39.53 90 top
C31  77.47,3.81 0 top
C32  10.16,49.21 180 top
C33  9.84,50.8 180 top
C34  17.62,49.85 0 top
C35  17.62,51.75 0 top
C36  11.75,15.56 180 top
C37  14.13,15.56 0 top
C38  11.75,17.14 180 top
C39  14.13,17.14 0 top
C40  9.84,14.13 90 top
C41  10.16,52.39 180 top
FPGA1  101.6,101.6 180 top
R1  62.23,5.08 0 top
R2  62.23,3.81 0 top
R3  77.47,8.89 0 top
R4  77.47,7.62 0 top
R5  10,87.47 180 top
R6  8.26,90.33 270 top
R7  13.81,86.04 180 top
R8  11.91,86.04 180 top
R13  10,62.07 180 top
R14  8.26,64.93 270 top
R15  13.81,60.64 180 top
R16  11.91,60.64 180 top
R21  10,36.67 180 top
R22  8.26,39.53 270 top
R23  13.81,35.24 180 top
R24  11.91,35.24 180 top
R29  10,11.27 180 top
R30  8.26,14.13 270 top
R31  13.81,9.84 180 top
R32  11.91,9.84 180 top
U1  13.97,50.8 270 top
U2  12.7,88.9 270 top
U4  12.7,63.5 270 top
U6  12.7,38.1 270 top
U8  12.7,12.7 270 top
VR1  62.23,17.78 0 top
VR2  77.47,17.78 0 top
X2  1.65,88.9 0 top
X4  1.65,63.5 0 top
X6  1.65,38.1 0 top
X8  1.65,12.7 0 top

### Tracks (layer width: path | path; a pad name or v marks a point on that pad's centre or on a via)
CHA_HYS_SET  (via drill 0.3)
  Top 0.203: R7.1 14.31,86.65 v14.13,86.84
CHA_LE/HYS
  Top 0.203: U2.8 12.7,86.68 12.41,86.38 R8.1 R7.2
CHA_OUT_N
  Top 0.152: 15.88,88.68 15.08,88.68 14.8,88.4 U2.10
CHA_OUT_P
  Top 0.152: 15.88,89.12 15.08,89.12 14.8,89.4 U2.12
CHA_SIG_IN
  Top 0.152: 11.29,88.4 arc-90 11.63,88.07 arc-90 11.03,87.47 R5.1 | U2.6 4.72,88.4 X2.1
  Top 0.203: U2.6 11.29,88.4
CHA_THRESH
  Top 0.203: U2.4 10.27,89.4 C10.1 R6.2
CHA_THRESH_SET  (via drill 0.3)
  Top 0.203: R6.1 8.28,90.83 v8.89,91.44
CHB_HYS_SET  (via drill 0.3)
  Top 0.203: R15.1 14.31,61.25 v14.13,61.44
CHB_LE/HYS
  Top 0.203: U4.8 12.7,61.28 12.41,60.98 R16.1 R15.2
CHB_OUT_N
  Top 0.152: 15.88,63.28 15.08,63.28 14.8,63 U4.10
CHB_OUT_P
  Top 0.152: 15.88,63.72 15.08,63.72 14.8,64 U4.12
CHB_SIG_IN
  Top 0.152: 11.29,63 arc-90 11.63,62.67 arc-90 11.03,62.07 R13.1 | U4.6 4.72,63 X4.1
  Top 0.203: U4.6 11.29,63
CHB_THRESH
  Top 0.203: U4.4 10.27,64 C20.1 R14.2
CHB_THRESH_SET  (via drill 0.3)
  Top 0.203: R14.1 8.28,65.43 v8.89,66.04
CHC_HYS_SET  (via drill 0.3)
  Top 0.203: R23.1 14.31,35.85 v14.13,36.04
CHC_LE/HYS
  Top 0.203: U6.8 12.7,35.88 12.41,35.58 R24.1 R23.2
CHC_OUT_N
  Top 0.152: 15.88,37.88 15.08,37.88 14.8,37.6 U6.10
CHC_OUT_P
  Top 0.152: 15.88,38.32 15.08,38.32 14.8,38.6 U6.12
CHC_SIG_IN
  Top 0.152: 11.29,37.6 arc-90 11.63,37.27 arc-90 11.03,36.67 R21.1 | U6.6 4.72,37.6 X6.1
  Top 0.203: U6.6 11.29,37.6
CHC_THRESH
  Top 0.203: U6.4 10.27,38.6 C30.1 R22.2
CHC_THRESH_SET  (via drill 0.3)
  Top 0.203: R22.1 8.28,40.03 v8.89,40.64
CHD_HYS_SET  (via drill 0.3)
  Top 0.203: R31.1 14.31,10.45 v14.13,10.64
CHD_LE/HYS
  Top 0.203: U8.8 12.7,10.48 12.41,10.18 R32.1 R31.2
CHD_OUT_N
  Top 0.152: 15.88,12.48 15.08,12.48 14.8,12.2 U8.10
CHD_OUT_P
  Top 0.152: 15.88,12.92 15.08,12.92 14.8,13.2 U8.12
CHD_SIG_IN
  Top 0.152: 11.29,12.2 arc-90 11.63,11.87 arc-90 11.03,11.27 R29.1 | U8.6 4.72,12.2 X8.1
  Top 0.203: U8.6 11.29,12.2
CHD_THRESH
  Top 0.203: U8.4 10.27,13.2 C40.1 R30.2
CHD_THRESH_SET  (via drill 0.3)
  Top 0.203: R30.1 8.28,14.63 v8.89,15.24
FPGA_VCCO_MC1  (1 unrouted)
FPGA_VCCO_MC2  (1 unrouted)
GND  (via drill 0.3)  (63 unrouted)
  Top 0.203: U2.5 U2.EPAD | U2.9 13.2,88.4 U2.EPAD | U2.11 U2.EPAD | U2.EPAD 12.2,89.4 U2.3 12.2,90.83 12.06,90.96 v11.91,90.96 11.25,91.62 C6.2 11.25,92.42 v11.11,92.55 11.25,92.69 C8.2 | v13.97,90.96 14.63,91.62 C7.2 14.63,92.42 v14.76,92.55 14.63,92.69 C9.2 | U2.7 12.2,86.97 12.06,86.84 v11.75,86.84 11.41,86.5 R8.2 | C10.2 10.45,90.83 v10.48,90.81 | R5.2 v8.89,87.47 | U4.5 U4.EPAD | U4.9 13.2,63 U4.EPAD | U4.11 U4.EPAD | U4.EPAD 12.2,64 U4.3 12.2,65.43 12.06,65.56 v11.91,65.56 11.25,66.22 C16.2 11.25,67.02 v11.11,67.15 11.25,67.29 C18.2 | v13.97,65.56 14.63,66.22 C17.2 14.63,67.02 v14.76,67.15 14.63,67.29 C19.2 | U4.7 12.2,61.57 12.06,61.44 v11.75,61.44 11.41,61.09 R16.2 | C20.2 10.45,65.43 v10.48,65.41 | R13.2 v8.89,62.07 | U6.5 U6.EPAD | U6.9 13.2,37.6 U6.EPAD | U6.11 U6.EPAD | U6.EPAD 12.2,38.6 U6.3 12.2,40.03 12.06,40.16 v11.91,40.16 11.25,40.82 C26.2 11.25,41.62 v11.11,41.75 11.25,41.89 C28.2 | v13.97,40.16 14.63,40.82 C27.2 14.63,41.62 v14.76,41.75 14.63,41.89 C29.2 | U6.7 12.2,36.17 12.06,36.04 v11.75,36.04 11.41,35.7 R24.2 | C30.2 10.45,40.03 v10.48,40.01 | R21.2 v8.89,36.67 | U8.5 U8.EPAD | U8.9 13.2,12.2 U8.EPAD | U8.11 U8.EPAD | U8.EPAD 12.2,13.2 U8.3 12.2,14.63 12.06,14.76 v11.91,14.76 11.25,15.42 C36.2 11.25,16.22 v11.11,16.35 11.25,16.49 C38.2 | v13.97,14.76 14.63,15.42 C37.2 14.63,16.22 v14.76,16.35 14.63,16.49 C39.2 | U8.7 12.2,10.77 12.06,10.64 v11.75,10.64 11.41,10.29 R32.2 | C40.2 10.45,14.63 v10.48,14.61 | R29.2 v8.89,11.27
  other vias: 12.38,89.22 13.02,89.22 13.02,88.58 12.38,88.58 3.17,93.98 3.81,93.98 4.45,93.98 5.08,93.98 5.71,93.98 6.35,93.98 3.17,93.34 3.81,93.34 4.45,93.34 5.08,93.34 5.71,93.34 6.35,93.34 6.35,92.71 5.71,92.71 5.08,92.71 4.45,92.71 3.81,92.71 3.17,92.71 3.17,85.09 3.81,85.09 4.45,85.09 5.08,85.09 5.71,85.09 6.35,85.09 6.35,84.45 6.35,83.82 5.71,83.82 5.08,83.82 4.45,83.82 3.81,83.82 3.17,83.82 3.17,84.45 3.81,84.45 4.45,84.45 5.08,84.45 5.71,84.45 12.38,63.82 13.02,63.82 13.02,63.18 12.38,63.18 3.17,68.58 3.81,68.58 4.45,68.58 5.08,68.58 5.71,68.58 6.35,68.58 3.17,67.94 3.81,67.94 4.45,67.94 5.08,67.94 5.71,67.94 6.35,67.94 6.35,67.31 5.71,67.31 5.08,67.31 4.45,67.31 3.81,67.31 3.17,67.31 3.17,59.69 3.81,59.69 4.45,59.69 5.08,59.69 5.71,59.69 6.35,59.69 6.35,59.05 6.35,58.42 5.71,58.42 5.08,58.42 4.45,58.42 3.81,58.42 3.17,58.42 3.17,59.05 3.81,59.05 4.45,59.05 5.08,59.05 5.71,59.05 12.38,38.42 13.02,38.42 13.02,37.78 12.38,37.78 3.17,43.18 3.81,43.18 4.45,43.18 5.08,43.18 5.71,43.18 6.35,43.18 3.17,42.55 3.81,42.55 4.45,42.55 5.08,42.55 5.71,42.55 6.35,42.55 6.35,41.91 5.71,41.91 5.08,41.91 4.45,41.91 3.81,41.91 3.17,41.91 3.17,34.29 3.81,34.29 4.45,34.29 5.08,34.29 5.71,34.29 6.35,34.29 6.35,33.66 6.35,33.02 5.71,33.02 5.08,33.02 4.45,33.02 3.81,33.02 3.17,33.02 3.17,33.66 3.81,33.66 4.45,33.66 5.08,33.66 5.71,33.66 12.38,13.02 13.02,13.02 13.02,12.38 12.38,12.38 3.17,17.78 3.81,17.78 4.45,17.78 5.08,17.78 5.71,17.78 6.35,17.78 3.17,17.14 3.81,17.14 4.45,17.14 5.08,17.14 5.71,17.14 6.35,17.14 6.35,16.51 5.71,16.51 5.08,16.51 4.45,16.51 3.81,16.51 3.17,16.51 3.17,8.89 3.81,8.89 4.45,8.89 5.08,8.89 5.71,8.89 6.35,8.89 6.35,8.26 6.35,7.62 5.71,7.62 5.08,7.62 4.45,7.62 3.81,7.62 3.17,7.62 3.17,8.26 3.81,8.26 4.45,8.26 5.08,8.26 5.71,8.26
  pour Route2: -12.7,114.3 114.3,114.3 114.3,-12.7 -12.7,-12.7
N$1  (4 unrouted)
N$3  (3 unrouted)
N$4  (1 unrouted)
N$7  (4 unrouted)
N$8  (1 unrouted)
N$10  (3 unrouted)
PP_P1V0_FPGA  (1 unrouted)
PP_P3V3_ANALOG  (via drill 0.3)  (14 unrouted)
  Top 0.203: U2.2 12.7,91.31 C6.1 12.25,92.37 v12.06,92.55 12.25,92.73 C8.1 | U4.2 12.7,65.91 C16.1 12.25,66.97 v12.06,67.15 12.25,67.33 C18.1 | U6.2 12.7,40.51 C26.1 12.25,41.57 v12.06,41.75 12.25,41.93 C28.1 | U8.2 12.7,15.11 C36.1 12.25,16.17 v12.06,16.35 12.25,16.53 C38.1
PP_P3V3_DIGITAL  (via drill 0.3)  (12 unrouted)
  Top 0.203: U2.1 13.2,91.33 C7.1 13.63,92.37 v13.81,92.55 13.63,92.73 C9.1 | U4.1 13.2,65.93 C17.1 13.63,66.97 v13.81,67.15 13.63,67.33 C19.1 | U6.1 13.2,40.53 C27.1 13.63,41.57 v13.81,41.75 13.63,41.93 C29.1 | U8.1 13.2,15.13 C37.1 13.63,16.17 v13.81,16.35 13.63,16.53 C39.1
PP_P3V3_FPGA  (5 unrouted)
PP_VDCIN_FPGA  (2 unrouted)